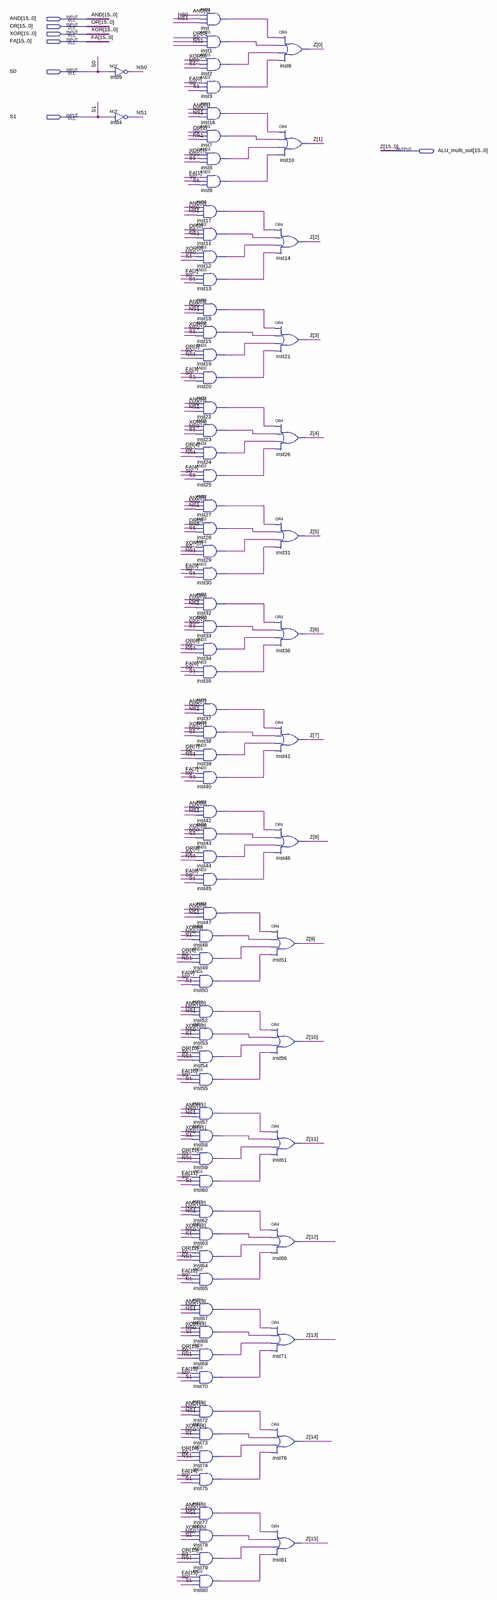
[diagram p0: schematic sheet, whole]
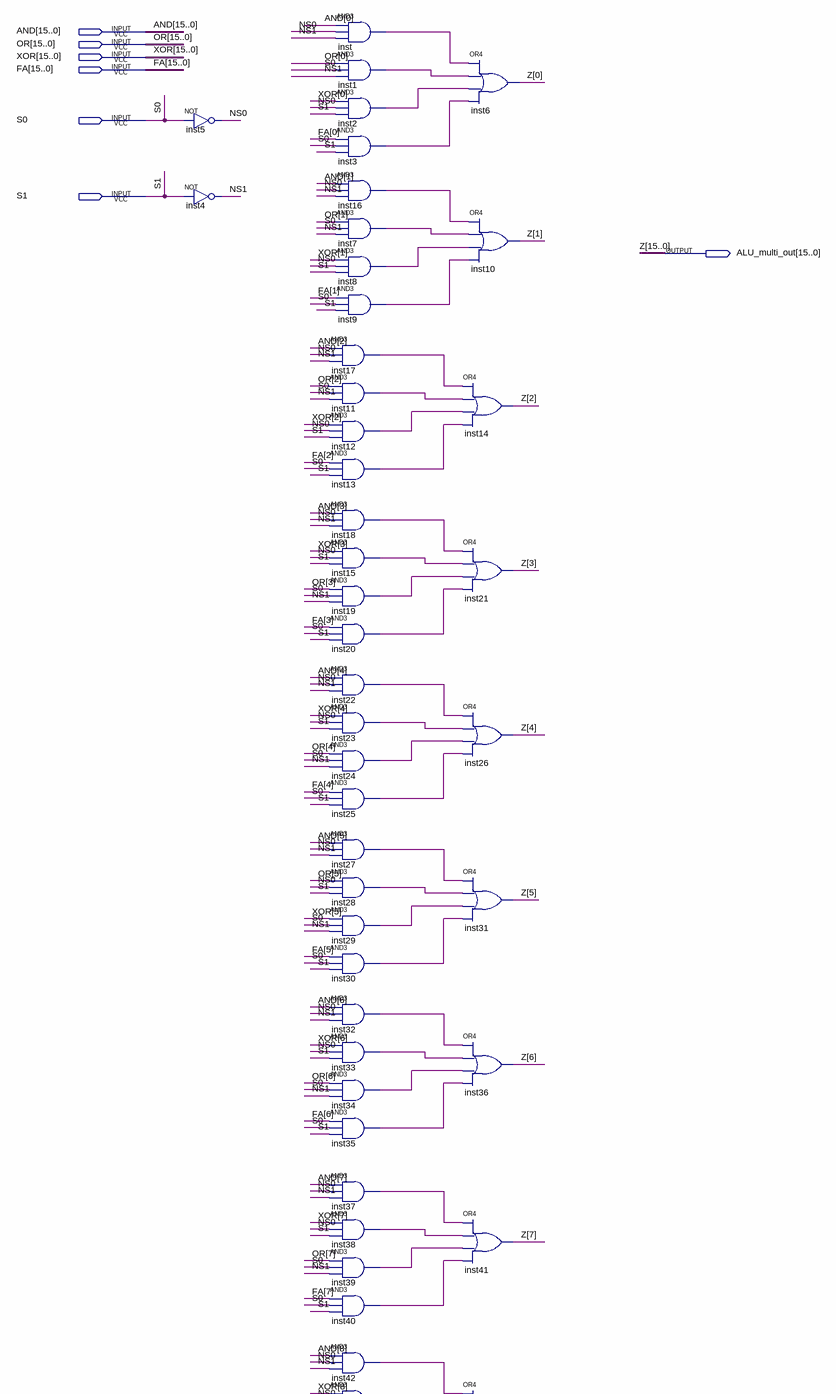
[diagram p1: schematic sheet, upper part]
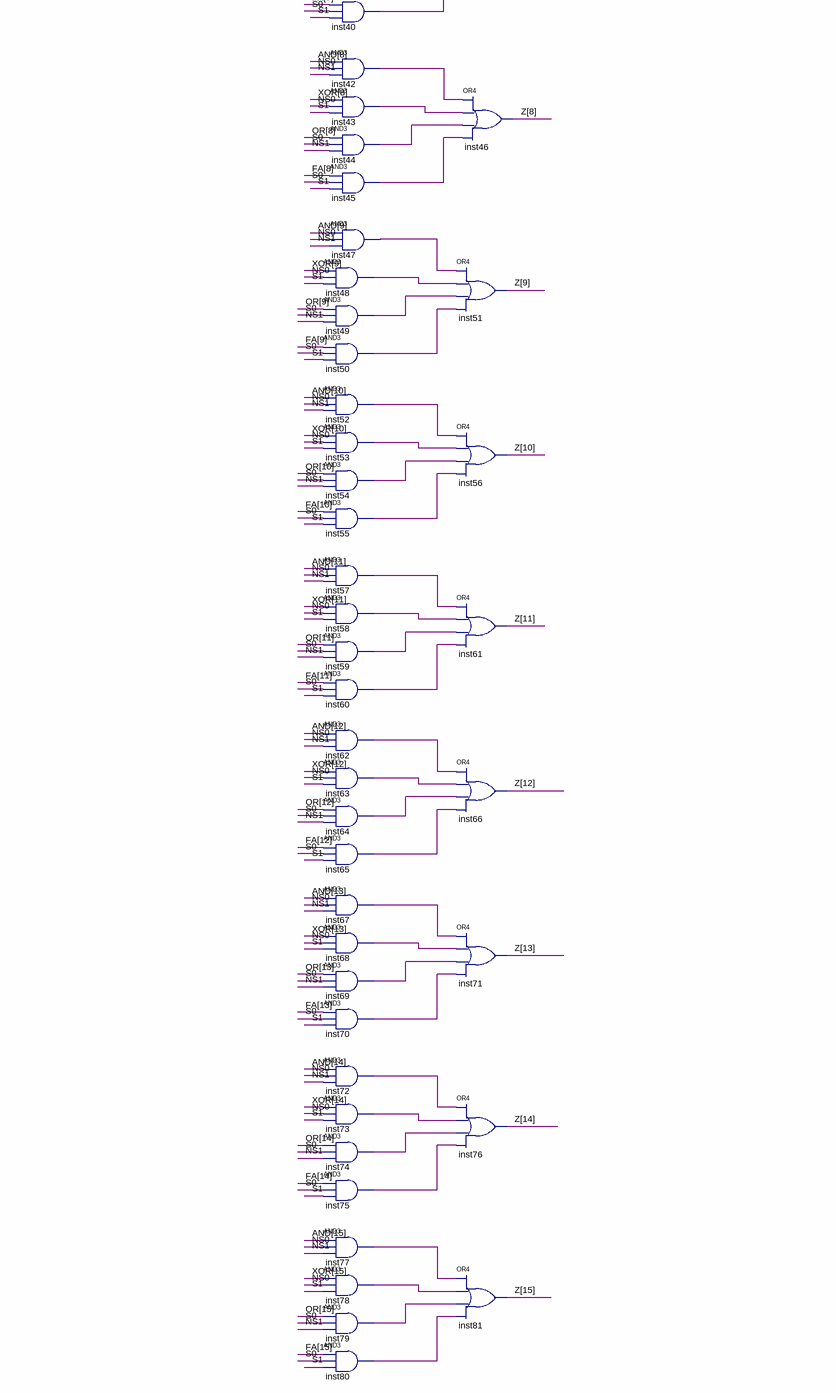
[diagram p2: schematic sheet, lower part]
// Quartus schematic ALU_out_multiplexer.bdf as structural Verilog: 82 symbols, 7 pins
module ALU_out_multiplexer (
  input  [15:0] AND,
  input  [15:0] OR,
  input  [15:0] XOR,
  input  [15:0] FA,
  input  S0,
  input  S1,
  output [15:0] ALU_multi_out
);

  wire inst1_out, inst2_out, inst3_out, inst7_out, inst8_out, inst9_out, inst11_out, inst12_out, inst13_out,
       inst15_out, inst16_out, inst17_out, inst18_out, inst19_out, inst20_out, inst22_out, inst23_out,
       inst24_out, inst25_out, inst27_out, inst28_out, inst29_out, inst30_out, inst32_out, inst33_out,
       inst34_out, inst35_out, inst37_out, inst38_out, inst39_out, inst40_out, inst42_out, inst43_out,
       inst44_out, inst45_out, inst47_out, inst48_out, inst49_out, inst50_out, inst52_out, inst53_out,
       inst54_out, inst55_out, inst57_out, inst58_out, inst59_out, inst60_out, inst62_out, inst63_out,
       inst64_out, inst65_out, inst67_out, inst68_out, inst69_out, inst70_out, inst72_out, inst73_out,
       inst74_out, inst75_out, inst77_out, inst78_out, inst79_out, inst80_out, inst_out, NS0, NS1;

  not inst5 (NS0, S0);
  not inst4 (NS1, S1);
  and inst (inst_out, AND[0], NS0, NS1);
  and inst1 (inst1_out, OR[0], S0, NS1);
  and inst2 (inst2_out, XOR[0], NS0, S1);
  and inst3 (inst3_out, FA[0], S0, S1);
  and inst16 (inst16_out, AND[1], NS0, NS1);
  and inst7 (inst7_out, OR[1], S0, NS1);
  and inst8 (inst8_out, XOR[1], NS0, S1);
  and inst9 (inst9_out, FA[1], S0, S1);
  and inst17 (inst17_out, AND[2], NS0, NS1);
  and inst11 (inst11_out, OR[2], S0, NS1);
  and inst12 (inst12_out, XOR[2], NS0, S1);
  and inst13 (inst13_out, FA[2], S0, S1);
  and inst18 (inst18_out, AND[3], NS0, NS1);
  and inst15 (inst15_out, XOR[3], NS0, S1);
  and inst19 (inst19_out, OR[3], S0, NS1);
  and inst20 (inst20_out, FA[3], S0, S1);
  and inst22 (inst22_out, AND[4], NS0, NS1);
  and inst23 (inst23_out, XOR[4], NS0, S1);
  and inst24 (inst24_out, OR[4], S0, NS1);
  and inst25 (inst25_out, FA[4], S0, S1);
  and inst27 (inst27_out, AND[5], NS0, NS1);
  and inst28 (inst28_out, OR[5], NS0, S1);
  and inst29 (inst29_out, XOR[5], S0, NS1);
  and inst30 (inst30_out, FA[5], S0, S1);
  and inst32 (inst32_out, AND[6], NS0, NS1);
  and inst33 (inst33_out, XOR[6], NS0, S1);
  and inst34 (inst34_out, OR[6], S0, NS1);
  and inst35 (inst35_out, FA[6], S0, S1);
  and inst37 (inst37_out, AND[7], NS0, NS1);
  and inst38 (inst38_out, XOR[7], NS0, S1);
  and inst39 (inst39_out, OR[7], S0, NS1);
  and inst40 (inst40_out, FA[7], S0, S1);
  and inst42 (inst42_out, AND[8], NS0, NS1);
  and inst43 (inst43_out, XOR[8], NS0, S1);
  and inst44 (inst44_out, OR[8], S0, NS1);
  and inst45 (inst45_out, FA[8], S0, S1);
  and inst47 (inst47_out, AND[9], NS0, NS1);
  and inst48 (inst48_out, XOR[9], NS0, S1);
  and inst49 (inst49_out, OR[9], S0, NS1);
  and inst50 (inst50_out, FA[9], S0, S1);
  and inst52 (inst52_out, AND[10], NS0, NS1);
  and inst53 (inst53_out, XOR[10], NS0, S1);
  and inst54 (inst54_out, OR[10], S0, NS1);
  and inst55 (inst55_out, FA[10], S0, S1);
  and inst57 (inst57_out, AND[11], NS0, NS1);
  and inst58 (inst58_out, XOR[11], NS0, S1);
  and inst59 (inst59_out, OR[11], S0, NS1);
  and inst60 (inst60_out, FA[11], S0, S1);
  and inst62 (inst62_out, AND[12], NS0, NS1);
  and inst63 (inst63_out, XOR[12], NS0, S1);
  and inst64 (inst64_out, OR[12], S0, NS1);
  and inst65 (inst65_out, FA[12], S0, S1);
  and inst67 (inst67_out, AND[13], NS0, NS1);
  and inst68 (inst68_out, XOR[13], NS0, S1);
  and inst69 (inst69_out, OR[13], S0, NS1);
  and inst70 (inst70_out, FA[13], S0, S1);
  and inst72 (inst72_out, AND[14], NS0, NS1);
  and inst73 (inst73_out, XOR[14], NS0, S1);
  and inst74 (inst74_out, OR[14], S0, NS1);
  and inst75 (inst75_out, FA[14], S0, S1);
  and inst77 (inst77_out, AND[15], NS0, NS1);
  and inst78 (inst78_out, XOR[15], NS0, S1);
  and inst79 (inst79_out, OR[15], S0, NS1);
  and inst80 (inst80_out, FA[15], S0, S1);
  or inst14 (ALU_multi_out[2], inst17_out, inst11_out, inst12_out, inst13_out);
  or inst21 (ALU_multi_out[3], inst18_out, inst15_out, inst19_out, inst20_out);
  or inst26 (ALU_multi_out[4], inst22_out, inst23_out, inst24_out, inst25_out);
  or inst31 (ALU_multi_out[5], inst27_out, inst28_out, inst29_out, inst30_out);
  or inst36 (ALU_multi_out[6], inst32_out, inst33_out, inst34_out, inst35_out);
  or inst41 (ALU_multi_out[7], inst37_out, inst38_out, inst39_out, inst40_out);
  or inst46 (ALU_multi_out[8], inst42_out, inst43_out, inst44_out, inst45_out);
  or inst51 (ALU_multi_out[9], inst47_out, inst48_out, inst49_out, inst50_out);
  or inst56 (ALU_multi_out[10], inst52_out, inst53_out, inst54_out, inst55_out);
  or inst61 (ALU_multi_out[11], inst57_out, inst58_out, inst59_out, inst60_out);
  or inst66 (ALU_multi_out[12], inst62_out, inst63_out, inst64_out, inst65_out);
  or inst71 (ALU_multi_out[13], inst67_out, inst68_out, inst69_out, inst70_out);
  or inst76 (ALU_multi_out[14], inst72_out, inst73_out, inst74_out, inst75_out);
  or inst81 (ALU_multi_out[15], inst77_out, inst78_out, inst79_out, inst80_out);
  or inst6 (ALU_multi_out[0], inst_out, inst1_out, inst2_out, inst3_out);
  or inst10 (ALU_multi_out[1], inst16_out, inst7_out, inst8_out, inst9_out);

  // Other names for the same wires on the sheet: Z[15:0] = ALU_multi_out
endmodule
